# Altium schematic sheet Main.SchDoc
size A3
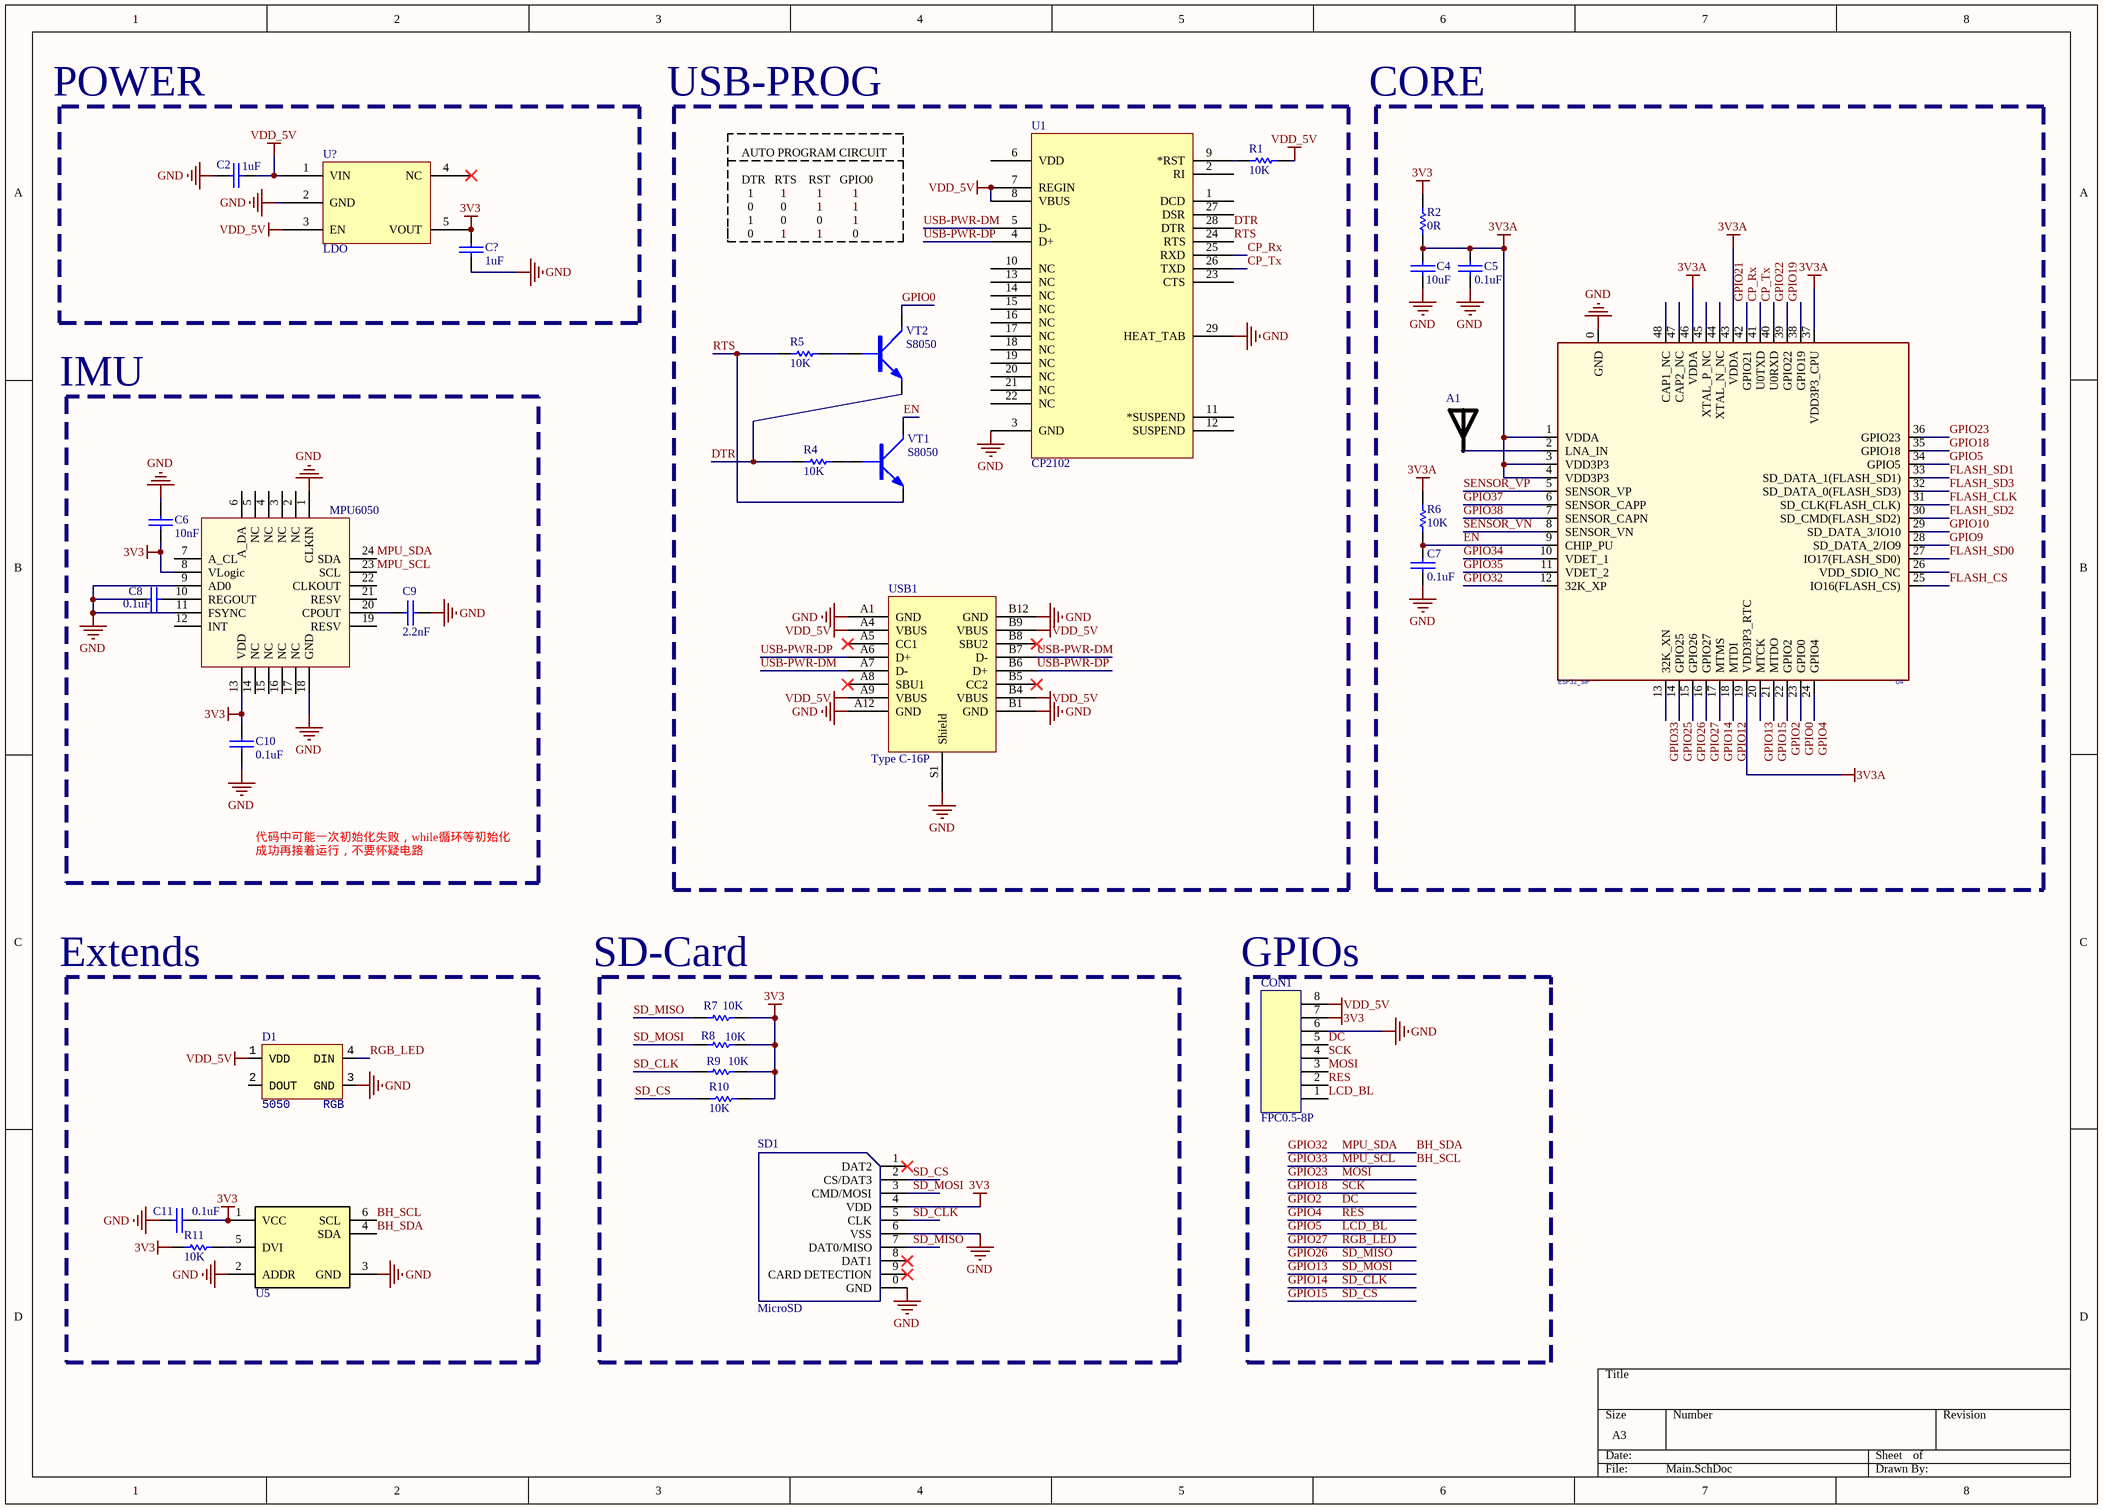
[diagram p0: Main.SchDoc]

## Parts
A1  RAINSUN  [ANT-Rainsun-AN5120]  (value not drawn)
C2  1uF  [0402C]
C4  10uF  [0402C]
C5  0.1uF  [0402C]
C6  10nF  [0402C]
C7  0.1uF  [0402C]
C8  0.1uF  [0402C]
C9  2.2nF  [0402C]
C10  0.1uF  [0402C]
C11  0.1uF  [0402C]
C?  1uF  [0402C]
CON1  FPC0.5-8P  [FPC0.5-8P]
D1  Type: 5050  [LED_5050_WS2812B]  (hidden comment: RGB)
R1  10K  [0402R]
R2  0R  [0402R]
R4  10K  [0402R]
R5  10K  [0402R]
R6  10K  [0402R]
R7  10K  [0402R]
R8  10K  [0402R]
R9  10K  [0402R]
R10  10K  [0402R]
R11  10K  [0402R]
SD1  MicroSD  [Micro SD]
U1  CP2102  [QFN-28]
U3  MPU6050  [QFN-24]
U4  ESP32_SIP  [QFN-48_7X7]
U5  BH1750FVI-TR  [BH1750FVI]  (value not drawn)
U?  LDO  [SOT23-5]
USB1  Type C-16P  [---TYPE C 16Pin SMD]
VT1  S8050  [SOT-23]
VT2  S8050  [SOT-23]

## Nets
3V3: C6.1 C10.1 C11.1 C?.1 CON1.7 R2.1 R7.1 R8.1 R9.1 R10.1 R11.2 SD1.4(VDD) U3.8(VLogic) U3.13(VDD) U5.1(VCC) U?.5(VOUT)
3V3A: C4.2 C5.2 R2.2 R6.1 U4.1(VDDA) U4.3(VDD3P3) U4.4(VDD3P3) U4.19(VDD3P3_RTC) U4.37(VDD3P3_CPU) U4.43(VDDA) U4.46(VDDA)
GND: C2.1 C4.1 C5.1 C6.2 C7.1 C8.2 C9.1 C10.2 C11.2 C?.2 CON1.6 D1.3(GND) SD1.0(GND) SD1.6(VSS) U1.3(GND) U1.29(HEAT_TAB) U3.1(CLKIN) U3.9(AD0) U3.11(FSYNC) U3.18(GND) U4.0(GND) U5.2(ADDR) U5.3(GND) U?.2(GND) USB1.A1(GND) USB1.A12(GND) USB1.B1(GND) USB1.B12(GND) USB1.S1(Shield)
VDD_5V: C2.2 CON1.8 D1.1(VDD) R1.1 U1.7(REGIN) U1.8(VBUS) U?.1(VIN) U?.3(EN) USB1.A4(VBUS) USB1.A9(VBUS) USB1.B4(VBUS) USB1.B9(VBUS)
BH_SCL: U3.23(SCL) U4.13(32K_XN) U5.6(SCL)  [also labelled GPIO33, MPU_SCL]
BH_SDA: U3.24(SDA) U4.12(32K_XP) U5.4(SDA)  [also labelled GPIO32, MPU_SDA]
CP_Rx: U1.25(RXD) U4.41(U0TXD)
CP_Tx: U1.26(TXD) U4.40(U0RXD)
DC: CON1.5 U4.22(GPIO2)  [also labelled GPIO2]
DTR: R4.2 U1.28(DTR) VT2.E
EN: C7.2 R6.2 U4.9(CHIP_PU) VT1.C
FLASH_CLK: U4.31(SD_CLK(FLASH_CLK))
FLASH_CS: U4.25(IO16(FLASH_CS))
FLASH_SD0: U4.27(IO17(FLASH_SD0))
FLASH_SD1: U4.33(SD_DATA_1(FLASH_SD1))
FLASH_SD2: U4.30(SD_CMD(FLASH_SD2))
FLASH_SD3: U4.32(SD_DATA_0(FLASH_SD3))
GPIO0: U4.23(GPIO0) VT2.C
GPIO4: CON1.2 U4.24(GPIO4)  [also labelled RES]
GPIO5: CON1.1 U4.34(GPIO5)  [also labelled LCD_BL]
GPIO9: U4.28(SD_DATA_2/IO9)
GPIO10: U4.29(SD_DATA_3/IO10)
GPIO12: U4.18(MTDI)
GPIO13: R8.2 SD1.3(CMD/MOSI) U4.20(MTCK)  [also labelled SD_MOSI]
GPIO14: R9.2 SD1.5(CLK) U4.17(MTMS)  [also labelled SD_CLK]
GPIO15: R10.2 SD1.2(CS/DAT3) U4.21(MTDO)  [also labelled SD_CS]
GPIO18: CON1.4 U4.35(GPIO18)  [also labelled SCK]
GPIO19: U4.38(GPIO19)
GPIO21: U4.42(GPIO21)
GPIO22: U4.39(GPIO22)
GPIO23: CON1.3 U4.36(GPIO23)  [also labelled MOSI]
GPIO25: U4.14(GPIO25)
GPIO26: R7.2 SD1.7(DAT0/MISO) U4.15(GPIO26)  [also labelled SD_MISO]
GPIO27: D1.4(DIN) U4.16(GPIO27)  [also labelled RGB_LED]
GPIO34: U4.10(VDET_1)
GPIO35: U4.11(VDET_2)
GPIO37: U4.6(SENSOR_CAPP)
GPIO38: U4.7(SENSOR_CAPN)
RTS: R5.2 U1.24(RTS) VT1.E
SENSOR_VN: U4.8(SENSOR_VN)
SENSOR_VP: U4.5(SENSOR_VP)
USB-PWR-DM: U1.5(D-) USB1.A7(D-) USB1.B7(D-)
USB-PWR-DP: U1.4(D+) USB1.A6(D+) USB1.B6(D+)
NetA1_1: A1.1 U4.2(LNA_IN)
NetC8_1: C8.1 U3.10(REGOUT)
NetC9_2: C9.2 U3.20(CPOUT)
NetR1_2: R1.2 U1.9(*RST)
NetR4_1: R4.1 VT1.B
NetR5_1: R5.1 VT2.B
NetR11_1: R11.1 U5.5(DVI)

Not connected (* = marked no-connect by the designer): D1 2(DOUT); SD1 1(DAT2)* 8(DAT1)* 9(CARD_DETECTION)*; U1 1(DCD) 2(RI) 6(VDD) 10(NC) 11(*SUSPEND) 12(SUSPEND) 13(NC) 14(NC) 15(NC) 16(NC) 17(NC) 18(NC) 19(NC) 20(NC) 21(NC) 22(NC) 23(CTS) 27(DSR); U3 2(NC) 3(NC) 4(NC) 5(NC) 6(A_DA) 7(A_CL) 12(INT) 14(NC) 15(NC) 16(NC) 17(NC) 19(RESV) 21(RESV) 22(CLKOUT); U4 26(VDD_SDIO_NC) 44(XTAL_N_NC) 45(XTAL_P_NC) 47(CAP2_NC) 48(CAP1_NC); U? 4(NC)*; USB1 A5(CC1)* A8(SBU1)* B5(CC2)* B8(SBU2)*

## Notes on the sheet
- POWER
- USB-PROG
- CORE
- AUTO PROGRAM CIRCUIT
  DTR   RTS    RST   GPIO0
  1         1          1          1
  0         0          1          1
  1         0          0          1
  0         1          1          0
- IMU
- 代码中可能一次初始化失败，while循环等初始化成功再接着运行，不要怀疑电路
- Extends
- (near R7) SD-Card
- (near CON1) GPIOs

## Library data of the parts
A1 = ANT-Rainsun-AP5120
C2 C4-C11 C? = CAP: 无极性电容
CON1 = FPC0.5-8P: 贴片
D1 = LED_5050_WS2812B: LED; Value: RGB
R1 R2 R4-R11 = RES
U1 = CP2102: USB转TTL; PART DESC: SINGLE-CHIP USB TO UART BRIDGE, QFN28, RoHS.; MFG #1: SILICON LABS; PART NUMBER: CP2102; Value: Value; RefDes: RefDes; Type: DEV
U3 = MPU6050: 六轴传感器
U4 = ESP32-PICO
U? = RT9013: max: 5.5V/500mA
VT1 VT2 = NPN: NPN三极管